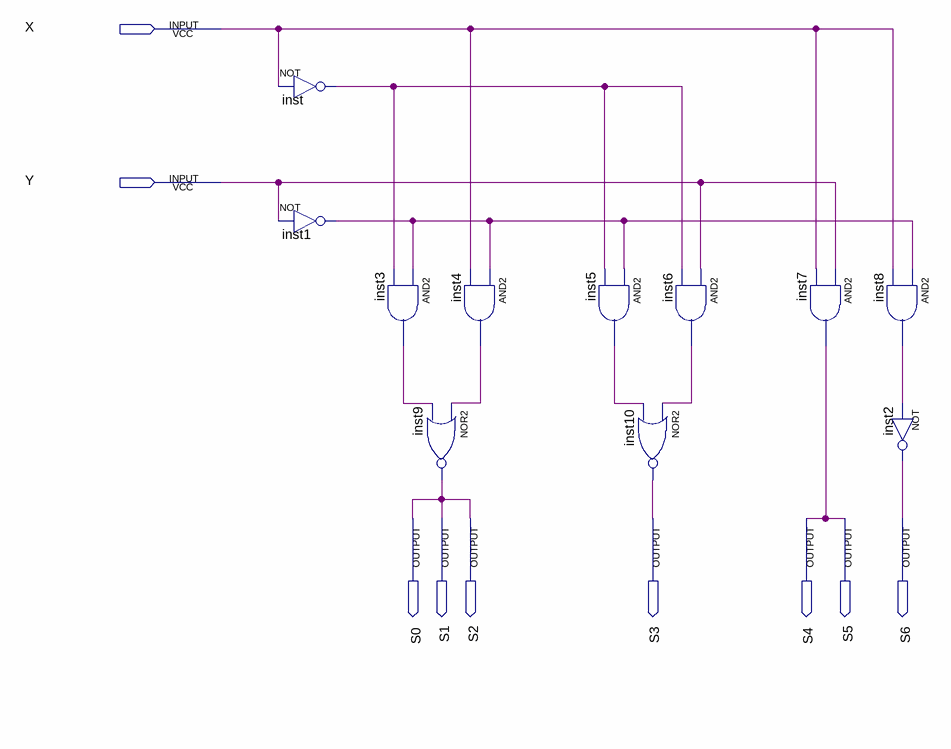
[diagram p0: schematic sheet]
// Quartus schematic Circuito_Base.bdf as structural Verilog: 11 symbols, 9 pins
module Circuito_Base (
  input  X,
  input  Y,
  output S0,
  output S1,
  output S2,
  output S3,
  output S4,
  output S5,
  output S6
);

  wire inst1_out, inst3_out, inst4_out, inst5_out, inst6_out, inst8_out, inst_out;

  not inst (inst_out, X);
  not inst1 (inst1_out, Y);
  and inst3 (inst3_out, inst1_out, inst_out);
  and inst4 (inst4_out, inst1_out, X);
  nor inst9 (S0, inst4_out, inst3_out);
  and inst5 (inst5_out, inst1_out, inst_out);
  and inst6 (inst6_out, Y, inst_out);
  nor inst10 (S3, inst6_out, inst5_out);
  and inst7 (S4, Y, X);
  and inst8 (inst8_out, inst1_out, X);
  not inst2 (S6, inst8_out);

  assign S1 = S0;
  assign S2 = S0;
  assign S5 = S4;
endmodule
